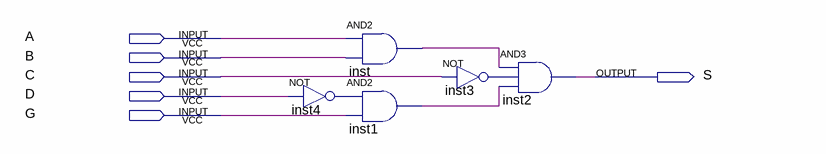
[diagram p0: schematic sheet]
// Quartus schematic Block7.bdf as structural Verilog: 5 symbols, 6 pins
module Block7 (
  input  A,
  input  B,
  input  C,
  input  D,
  input  G,
  output S
);

  wire inst1_out, inst3_out, inst4_out, inst_out;

  not inst4 (inst4_out, D);
  and inst (inst_out, A, B);
  and inst1 (inst1_out, inst4_out, G);
  not inst3 (inst3_out, C);
  and inst2 (S, inst_out, inst3_out, inst1_out);
endmodule
